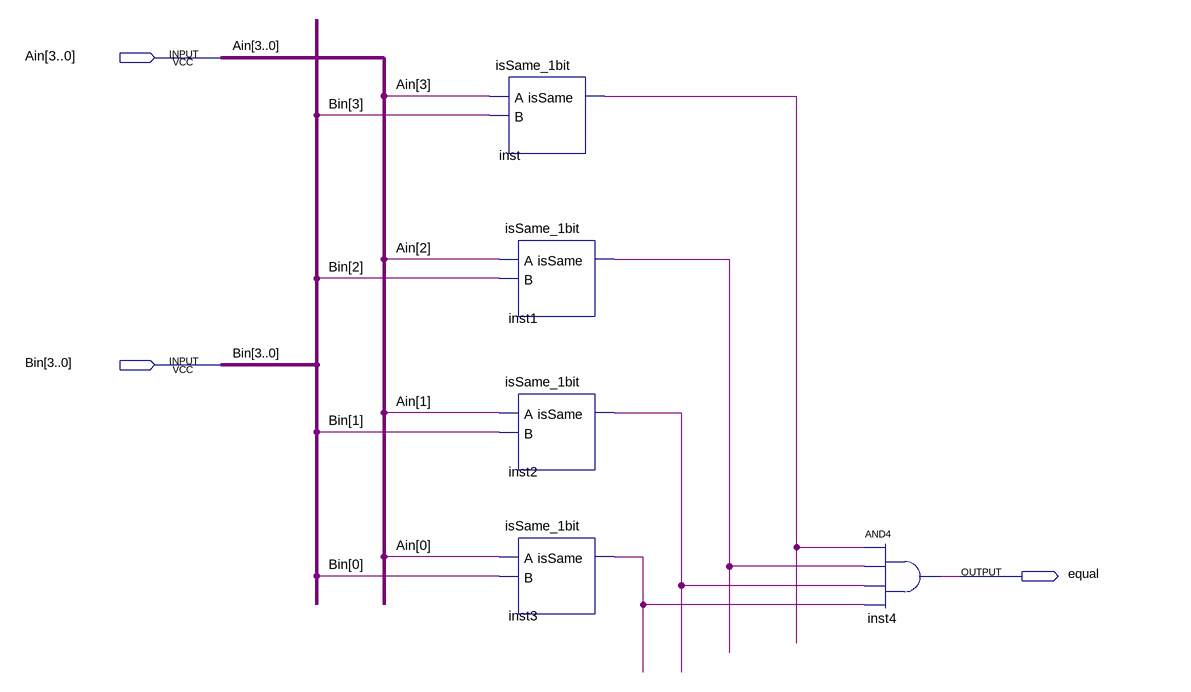
[diagram p0: schematic sheet]
// Quartus schematic four_bit_equal.bdf as structural Verilog: 5 symbols, 3 pins
module four_bit_equal (
  input  [3:0] Ain,
  input  [3:0] Bin,
  output equal
);

  wire inst1_issame, inst2_issame, inst3_issame, inst_issame;

  isSame_1bit inst (.A(Ain[3]), .B(Bin[3]), .isSame(inst_issame));
  isSame_1bit inst1 (.A(Ain[2]), .B(Bin[2]), .isSame(inst1_issame));
  isSame_1bit inst2 (.A(Ain[1]), .B(Bin[1]), .isSame(inst2_issame));
  isSame_1bit inst3 (.A(Ain[0]), .B(Bin[0]), .isSame(inst3_issame));
  and inst4 (equal, inst_issame, inst1_issame, inst2_issame, inst3_issame);
endmodule
